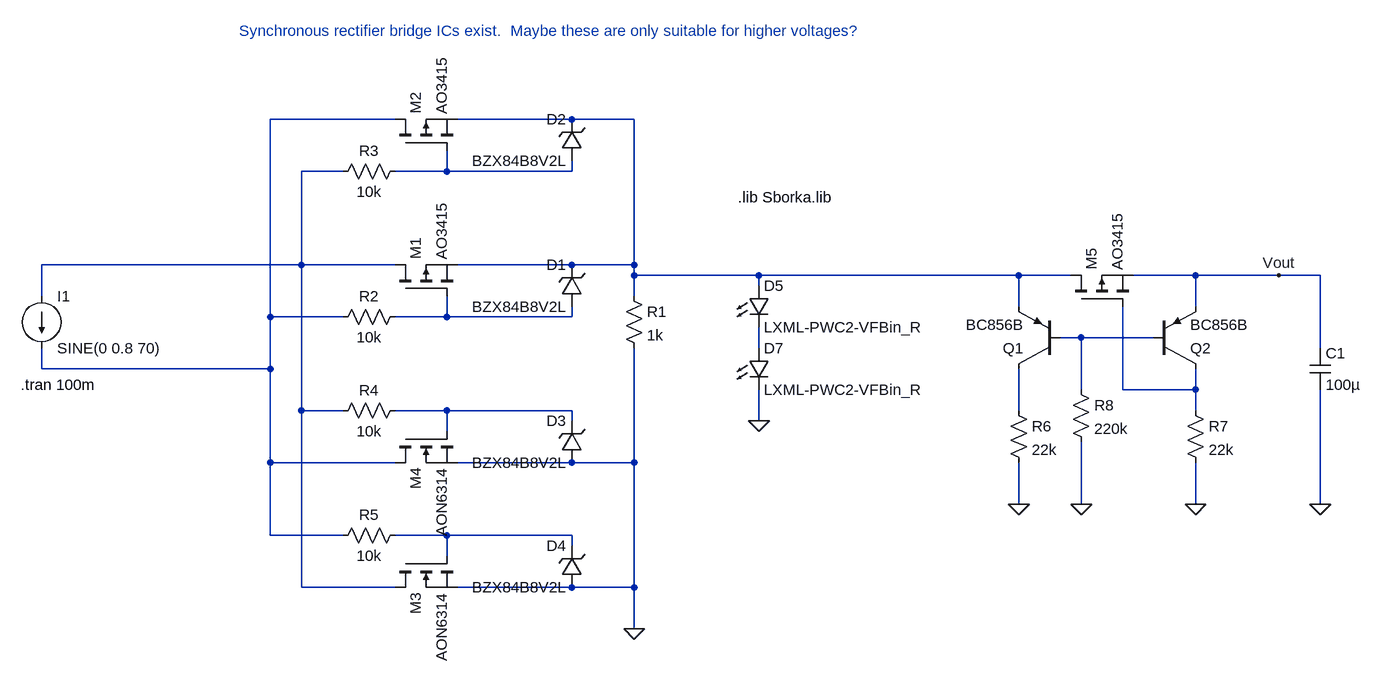
[diagram p0: schematic synchro-rect.asc]
synchro-rect.asc, the LTspice schematic file:
Version 4
SHEET 1 1480 680
WIRE -16 -160 -208 -160
WIRE 256 -160 80 -160
WIRE 352 -160 256 -160
WIRE -96 -80 -160 -80
WIRE 64 -80 64 -112
WIRE 64 -80 -16 -80
WIRE 256 -80 256 -96
WIRE 256 -80 64 -80
WIRE -160 64 -160 -80
WIRE -160 64 -560 64
WIRE -16 64 -160 64
WIRE 256 64 80 64
WIRE 352 64 352 -160
WIRE 352 64 256 64
WIRE 352 80 352 64
WIRE 544 80 352 80
WIRE 944 80 544 80
WIRE 1024 80 944 80
WIRE 1216 80 1120 80
WIRE 1344 80 1216 80
WIRE 1408 80 1344 80
WIRE 544 96 544 80
WIRE -560 112 -560 64
WIRE 352 112 352 80
WIRE 944 128 944 80
WIRE 1216 128 1216 80
WIRE -208 144 -208 -160
WIRE -96 144 -208 144
WIRE 64 144 64 112
WIRE 64 144 -16 144
WIRE 256 144 256 128
WIRE 256 144 64 144
WIRE 1040 176 1008 176
WIRE 1152 176 1040 176
WIRE 544 192 544 160
WIRE 1408 192 1408 80
WIRE -560 224 -560 192
WIRE -208 224 -208 144
WIRE -208 224 -560 224
WIRE 1040 256 1040 176
WIRE 1104 256 1104 128
WIRE 1216 256 1216 224
WIRE 1216 256 1104 256
WIRE -160 288 -160 64
WIRE -96 288 -160 288
WIRE 64 288 -16 288
WIRE 256 288 64 288
WIRE 944 288 944 224
WIRE 1216 288 1216 256
WIRE 256 304 256 288
WIRE 544 304 544 256
WIRE 64 320 64 288
WIRE -208 368 -208 224
WIRE -16 368 -208 368
WIRE 256 368 80 368
WIRE 352 368 352 192
WIRE 352 368 256 368
WIRE 944 432 944 368
WIRE 1040 432 1040 336
WIRE 1216 432 1216 368
WIRE 1408 432 1408 256
WIRE -208 480 -208 368
WIRE -96 480 -208 480
WIRE 64 480 -16 480
WIRE 256 480 64 480
WIRE 256 496 256 480
WIRE 64 512 64 480
WIRE -160 560 -160 288
WIRE -16 560 -160 560
WIRE 256 560 80 560
WIRE 352 560 352 368
WIRE 352 560 256 560
WIRE 352 624 352 560
FLAG 352 624 0
FLAG 544 304 0
FLAG 944 432 0
FLAG 1216 432 0
FLAG 1408 432 0
FLAG 1344 80 Vout
FLAG 1040 432 0
SYMBOL pmos -16 112 R270
SYMATTR InstName M1
SYMATTR Value AO3415
SYMBOL res 336 96 R0
SYMATTR InstName R1
SYMATTR Value 1k
SYMBOL zener 272 128 R180
WINDOW 0 24 64 Left 2
WINDOW 3 24 0 Left 2
SYMATTR InstName D1
SYMATTR Value BZX84B8V2L
SYMATTR Description Diode
SYMATTR Type diode
SYMBOL res 0 128 R90
WINDOW 0 0 56 VBottom 2
WINDOW 3 32 56 VTop 2
SYMATTR InstName R2
SYMATTR Value 10k
SYMBOL pmos -16 -112 R270
SYMATTR InstName M2
SYMATTR Value AO3415
SYMBOL zener 272 -96 R180
WINDOW 0 24 64 Left 2
WINDOW 3 24 0 Left 2
SYMATTR InstName D2
SYMATTR Value BZX84B8V2L
SYMATTR Description Diode
SYMATTR Type diode
SYMBOL res 0 -96 R90
WINDOW 0 0 56 VBottom 2
WINDOW 3 32 56 VTop 2
SYMATTR InstName R3
SYMATTR Value 10k
SYMBOL zener 272 368 R180
WINDOW 0 24 64 Left 2
WINDOW 3 24 0 Left 2
SYMATTR InstName D3
SYMATTR Value BZX84B8V2L
SYMATTR Description Diode
SYMATTR Type diode
SYMBOL zener 272 560 R180
WINDOW 0 24 64 Left 2
WINDOW 3 24 0 Left 2
SYMATTR InstName D4
SYMATTR Value BZX84B8V2L
SYMATTR Description Diode
SYMATTR Type diode
SYMBOL res 0 272 R90
WINDOW 0 0 56 VBottom 2
WINDOW 3 32 56 VTop 2
SYMATTR InstName R4
SYMATTR Value 10k
SYMBOL res 0 464 R90
WINDOW 0 0 56 VBottom 2
WINDOW 3 32 56 VTop 2
SYMATTR InstName R5
SYMATTR Value 10k
SYMBOL nmos -16 512 M90
SYMATTR InstName M3
SYMATTR Value AON6314
SYMBOL nmos -16 320 M90
SYMATTR InstName M4
SYMATTR Value AON6314
SYMBOL LED 528 96 R0
SYMATTR InstName D5
SYMATTR Value LXML-PWC2-VFBin_R
SYMATTR Description Diode
SYMATTR Type diode
SYMBOL LED 528 192 R0
SYMATTR InstName D7
SYMATTR Value LXML-PWC2-VFBin_R
SYMATTR Description Diode
SYMATTR Type diode
SYMBOL current -560 112 R0
WINDOW 123 0 0 Left 0
WINDOW 39 0 0 Left 0
SYMATTR InstName I1
SYMATTR Value SINE(0 0.8 70)
SYMBOL pnp 1008 224 R180
SYMATTR InstName Q1
SYMATTR Value BC856B
SYMBOL pnp 1152 224 M180
SYMATTR InstName Q2
SYMATTR Value BC856B
SYMBOL res 928 272 R0
SYMATTR InstName R6
SYMATTR Value 22k
SYMBOL res 1200 272 R0
SYMATTR InstName R7
SYMATTR Value 22k
SYMBOL pmos 1024 128 R270
SYMATTR InstName M5
SYMATTR Value AO3415
SYMBOL cap 1392 192 R0
SYMATTR InstName C1
SYMATTR Value 100µ
SYMBOL res 1024 240 R0
SYMATTR InstName R8
SYMATTR Value 220k
TEXT 512 -40 Left 2 !.lib Sborka.lib
TEXT -592 248 Left 2 !.tran 100m
TEXT -256 -296 Left 2 ;Synchronous rectifier bridge ICs exist.  Maybe these are only suitable for higher voltages?

The netlist it stands for:
* synchro-rect.asc
M1 N003 N005 N002 N002 AO3415
R1 N002 0 1k
D1 N005 N002 BZX84B8V2L
R2 N005 N001 10k
M2 N001 N004 N002 N002 AO3415
D2 N004 N002 BZX84B8V2L
R3 N004 N003 10k
D3 0 N009 BZX84B8V2L
D4 0 N011 BZX84B8V2L
R4 N009 N003 10k
R5 N011 N001 10k
M3 N003 N011 0 0 AON6314
M4 N001 N009 0 0 AON6314
D5 N002 N007 LXML-PWC2-VFBin_R
D7 N007 0 LXML-PWC2-VFBin_R
I1 N003 N001 SINE(0 0.8 70)
Q1 N010 N006 N002 0 BC856B
Q2 N008 N006 Vout 0 BC856B
R6 N010 0 22k
R7 N008 0 22k
M5 N002 N008 Vout Vout AO3415
C1 Vout 0 100µ
R8 N006 0 220k
.model D D
.lib standard.dio
.model NPN NPN
.model PNP PNP
.lib standard.bjt
.model NMOS NMOS
.model PMOS PMOS
.lib standard.mos
.lib Sborka.lib
.tran 100m
* Synchronous rectifier bridge ICs exist.  Maybe these are only suitable for higher voltages?
.backanno
.end